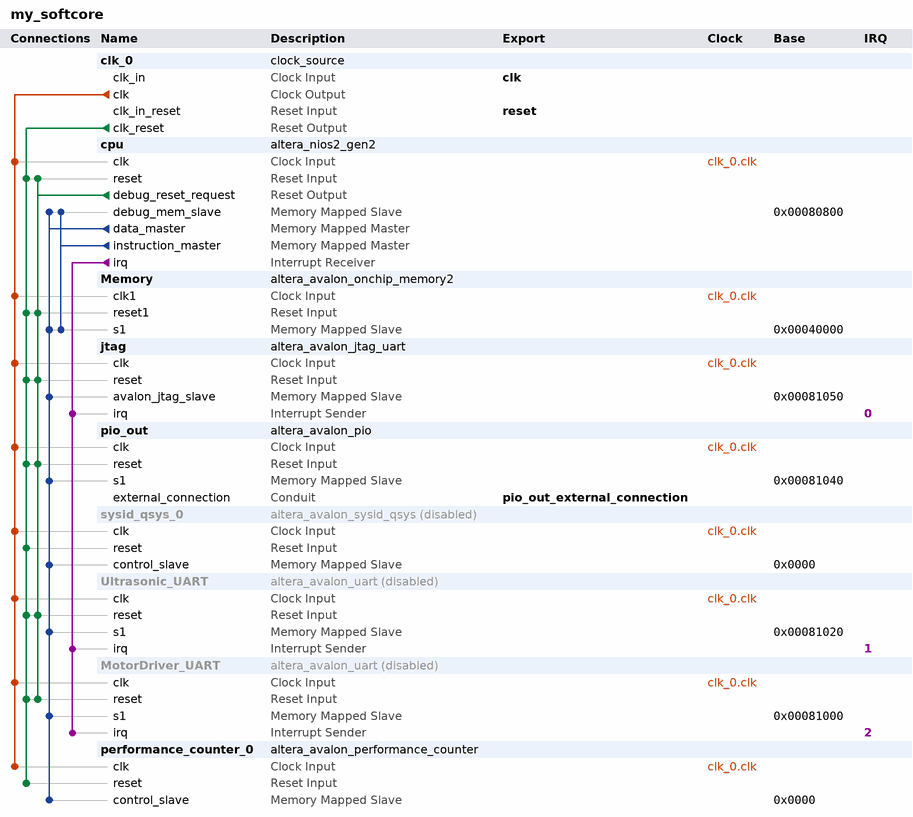
[diagram p0: system contents]
# Platform Designer (Qsys) system my_softcore, Cyclone IV E EP4CE115F29C7
# Parameters at their usual value, and those the tool derives, are not listed.
package require -exact qsys 20.1
create_system my_softcore
set_project_property DEVICE_FAMILY {Cyclone IV E}
set_project_property DEVICE EP4CE115F29C7

add_instance clk_0 clock_source 20.1
set_instance_parameter_value clk_0 clockFrequency 50000000

add_instance cpu altera_nios2_gen2 20.1
set_instance_parameter_value cpu dcache_size 2048
set_instance_parameter_value cpu exceptionSlave Memory.s1
set_instance_parameter_value cpu icache_size 4096
set_instance_parameter_value cpu impl Tiny
set_instance_parameter_value cpu resetSlave Memory.s1

add_instance Memory altera_avalon_onchip_memory2 20.1
set_instance_parameter_value Memory dataWidth 32
set_instance_parameter_value Memory dualPort false
set_instance_parameter_value Memory initMemContent true
set_instance_parameter_value Memory initializationFileName onchip_mem.hex
set_instance_parameter_value Memory memorySize 204800

add_instance jtag altera_avalon_jtag_uart 20.1
set_instance_parameter_value jtag simInteractiveOptions NO_INTERACTIVE_WINDOWS

add_instance pio_out altera_avalon_pio 20.1
set_instance_parameter_value pio_out direction InOut
set_instance_parameter_value pio_out width 32

add_instance sysid_qsys_0 altera_avalon_sysid_qsys 20.1
set_instance_property sysid_qsys_0 ENABLED false
set_instance_parameter_value sysid_qsys_0 id 0

add_instance Ultrasonic_UART altera_avalon_uart 20.1
set_instance_property Ultrasonic_UART ENABLED false
set_instance_parameter_value Ultrasonic_UART baud 115200
set_instance_parameter_value Ultrasonic_UART dataBits 8
set_instance_parameter_value Ultrasonic_UART fixedBaud true
set_instance_parameter_value Ultrasonic_UART parity NONE
set_instance_parameter_value Ultrasonic_UART stopBits 1

add_instance MotorDriver_UART altera_avalon_uart 20.1
set_instance_property MotorDriver_UART ENABLED false
set_instance_parameter_value MotorDriver_UART baud 115200
set_instance_parameter_value MotorDriver_UART dataBits 8
set_instance_parameter_value MotorDriver_UART fixedBaud true
set_instance_parameter_value MotorDriver_UART parity NONE
set_instance_parameter_value MotorDriver_UART stopBits 1

add_instance performance_counter_0 altera_avalon_performance_counter 20.1
set_instance_parameter_value performance_counter_0 numberOfSections 3

# connections
add_connection clk_0.clk cpu.clk clock
add_connection clk_0.clk jtag.clk clock
add_connection clk_0.clk Memory.clk1 clock
add_connection clk_0.clk MotorDriver_UART.clk clock
add_connection clk_0.clk performance_counter_0.clk clock
add_connection clk_0.clk pio_out.clk clock
add_connection clk_0.clk sysid_qsys_0.clk clock
add_connection clk_0.clk Ultrasonic_UART.clk clock
add_connection clk_0.clk_reset cpu.reset reset
add_connection clk_0.clk_reset jtag.reset reset
add_connection clk_0.clk_reset Memory.reset1 reset
add_connection clk_0.clk_reset MotorDriver_UART.reset reset
add_connection clk_0.clk_reset performance_counter_0.reset reset
add_connection clk_0.clk_reset pio_out.reset reset
add_connection clk_0.clk_reset sysid_qsys_0.reset reset
add_connection clk_0.clk_reset Ultrasonic_UART.reset reset
add_connection cpu.debug_reset_request cpu.reset reset
add_connection cpu.debug_reset_request jtag.reset reset
add_connection cpu.debug_reset_request Memory.reset1 reset
add_connection cpu.debug_reset_request MotorDriver_UART.reset reset
add_connection cpu.debug_reset_request pio_out.reset reset
add_connection cpu.debug_reset_request Ultrasonic_UART.reset reset
add_connection cpu.data_master cpu.debug_mem_slave avalon
set_connection_parameter_value cpu.data_master/cpu.debug_mem_slave baseAddress 0x00080800
add_connection cpu.data_master jtag.avalon_jtag_slave avalon
set_connection_parameter_value cpu.data_master/jtag.avalon_jtag_slave baseAddress 0x00081050
add_connection cpu.data_master Memory.s1 avalon
set_connection_parameter_value cpu.data_master/Memory.s1 baseAddress 0x00040000
add_connection cpu.data_master MotorDriver_UART.s1 avalon
set_connection_parameter_value cpu.data_master/MotorDriver_UART.s1 baseAddress 0x00081000
add_connection cpu.data_master performance_counter_0.control_slave avalon
set_connection_parameter_value cpu.data_master/performance_counter_0.control_slave baseAddress 0x0000
add_connection cpu.data_master pio_out.s1 avalon
set_connection_parameter_value cpu.data_master/pio_out.s1 baseAddress 0x00081040
add_connection cpu.data_master sysid_qsys_0.control_slave avalon
set_connection_parameter_value cpu.data_master/sysid_qsys_0.control_slave baseAddress 0x0000
add_connection cpu.data_master Ultrasonic_UART.s1 avalon
set_connection_parameter_value cpu.data_master/Ultrasonic_UART.s1 baseAddress 0x00081020
add_connection cpu.instruction_master cpu.debug_mem_slave avalon
set_connection_parameter_value cpu.instruction_master/cpu.debug_mem_slave baseAddress 0x00080800
add_connection cpu.instruction_master Memory.s1 avalon
set_connection_parameter_value cpu.instruction_master/Memory.s1 baseAddress 0x00040000
add_connection cpu.irq jtag.irq interrupt
set_connection_parameter_value cpu.irq/jtag.irq irqNumber 0
add_connection cpu.irq MotorDriver_UART.irq interrupt
set_connection_parameter_value cpu.irq/MotorDriver_UART.irq irqNumber 2
add_connection cpu.irq Ultrasonic_UART.irq interrupt
set_connection_parameter_value cpu.irq/Ultrasonic_UART.irq irqNumber 1

# exported interfaces
add_interface clk clock sink
set_interface_property clk EXPORT_OF clk_0.clk_in
add_interface pio_out_external_connection conduit end
set_interface_property pio_out_external_connection EXPORT_OF pio_out.external_connection
add_interface reset reset sink
set_interface_property reset EXPORT_OF clk_0.clk_in_reset

set_interconnect_requirement {$system} qsys_mm.clockCrossingAdapter HANDSHAKE
set_interconnect_requirement {$system} qsys_mm.enableEccProtection FALSE
set_interconnect_requirement {$system} qsys_mm.insertDefaultSlave FALSE
set_interconnect_requirement {$system} qsys_mm.maxAdditionalLatency 1

save_system my_softcore.qsys
